# Altium schematic sheet FPGA_Core.SchDoc
size A; DocumentNumber: 5; SheetNumber: 5; SheetTotal: 8; PageSetup: Record=PageOptions|CenterHorizontal=True|CenterVertical=True|PrintScale=1.12|XCorrection=1.00|YCorrection=1.00|PrintKind=0|BorderSize=5000000|LeftOffset=0|BottomOffset=0|Orientation=2|PaperLength=1000|PaperWidth=1000|Scale=100|PaperSource=7|PrintQuality=-4|MediaType=1|DitherType=10|PaperKind=Letter|PrintScaleMode=1
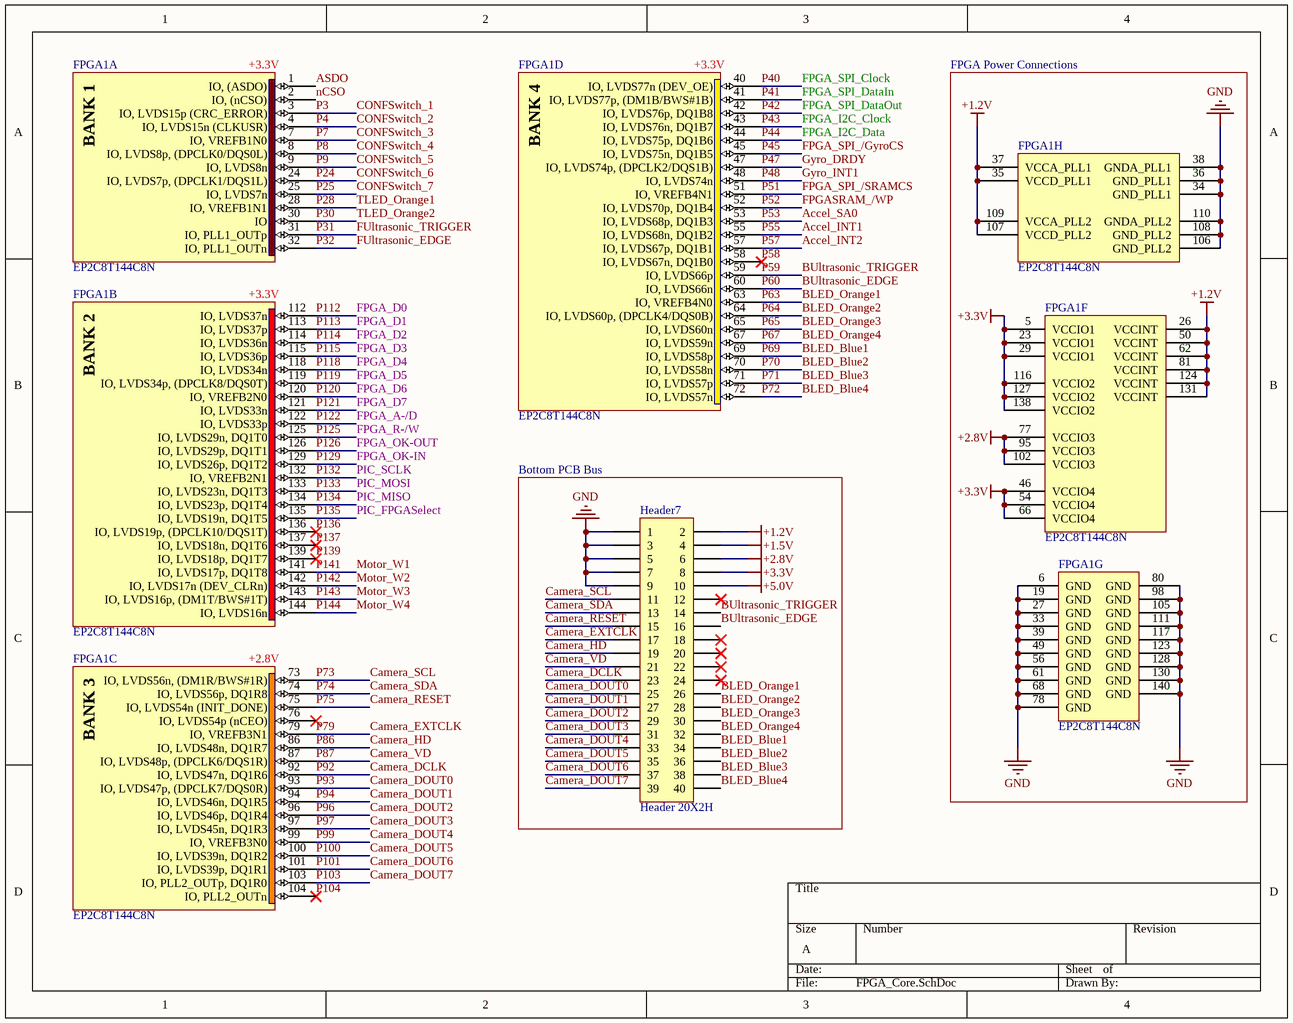
[diagram p0: FPGA_Core.SchDoc]

## Parts
FPGA1  EP2C8T144C8N  [TQFP144_N]  (parts A,B,C,D,F,G,H of 9)
Header7  Header 20X2H  [HDR2X20]

## Blocks framed on the sheet
FPGA Power Connections: FPGA1
Bottom PCB Bus: Header7

## Nets
+1.2V: FPGA1.26(VCCINT) FPGA1.35(VCCD_PLL1) FPGA1.37(VCCA_PLL1) FPGA1.50(VCCINT) FPGA1.62(VCCINT) FPGA1.81(VCCINT) FPGA1.107(VCCD_PLL2) FPGA1.109(VCCA_PLL2) FPGA1.124(VCCINT) FPGA1.131(VCCINT) Header7.2
+1.5V: Header7.4
+2.8V: FPGA1.77(VCCIO3) FPGA1.95(VCCIO3) FPGA1.102(VCCIO3) Header7.6
+3.3V: FPGA1.5(VCCIO1) FPGA1.23(VCCIO1) FPGA1.29(VCCIO1) FPGA1.46(VCCIO4) FPGA1.54(VCCIO4) FPGA1.66(VCCIO4) FPGA1.116(VCCIO2) FPGA1.127(VCCIO2) FPGA1.138(VCCIO2) Header7.8
+5.0V: Header7.10
GND: FPGA1.6(GND) FPGA1.19(GND) FPGA1.27(GND) FPGA1.33(GND) FPGA1.34(GND_PLL1) FPGA1.36(GND_PLL1) FPGA1.38(GNDA_PLL1) FPGA1.39(GND) FPGA1.49(GND) FPGA1.56(GND) FPGA1.61(GND) FPGA1.68(GND) FPGA1.78(GND) FPGA1.80(GND) FPGA1.98(GND) FPGA1.105(GND) FPGA1.106(GND_PLL2) FPGA1.108(GND_PLL2) FPGA1.110(GNDA_PLL2) FPGA1.111(GND) FPGA1.117(GND) FPGA1.123(GND) FPGA1.128(GND) FPGA1.130(GND) FPGA1.140(GND) Header7.1 Header7.3 Header7.5 Header7.7 Header7.9
Accel_INT1: FPGA1.55(IO,_LVDS68n,_DQ1B2)  [also labelled P55]
Accel_INT2: FPGA1.57(IO,_LVDS67p,_DQ1B1)  [also labelled P57]
Accel_SA0: FPGA1.53(IO,_LVDS68p,_DQ1B3)  [also labelled P53]
ASDO: FPGA1.1(IO,_(ASDO))
BLED_Blue1: FPGA1.69(IO,_LVDS58p) Header7.34  [also labelled P69]
BLED_Blue2: FPGA1.70(IO,_LVDS58n) Header7.36  [also labelled P70]
BLED_Blue3: FPGA1.71(IO,_LVDS57p) Header7.38  [also labelled P71]
BLED_Blue4: FPGA1.72(IO,_LVDS57n) Header7.40  [also labelled P72]
BLED_Orange1: FPGA1.63(IO,_VREFB4N0) Header7.26  [also labelled P63]
BLED_Orange2: FPGA1.64(IO,_LVDS60p,_(DPCLK4/DQS0B)) Header7.28  [also labelled P64]
BLED_Orange3: FPGA1.65(IO,_LVDS60n) Header7.30  [also labelled P65]
BLED_Orange4: FPGA1.67(IO,_LVDS59n) Header7.32  [also labelled P67]
BUltrasonic_EDGE: FPGA1.60(IO,_LVDS66n) Header7.16  [also labelled P60]
BUltrasonic_TRIGGER: FPGA1.59(IO,_LVDS66p) Header7.14  [also labelled P59]
Camera_DCLK: FPGA1.92(IO,_LVDS47n,_DQ1R6) Header7.23  [also labelled P92]
Camera_DOUT0: FPGA1.93(IO,_LVDS47p,_(DPCLK7/DQS0R)) Header7.25  [also labelled P93]
Camera_DOUT1: FPGA1.94(IO,_LVDS46n,_DQ1R5) Header7.27  [also labelled P94]
Camera_DOUT2: FPGA1.96(IO,_LVDS46p,_DQ1R4) Header7.29  [also labelled P96]
Camera_DOUT3: FPGA1.97(IO,_LVDS45n,_DQ1R3) Header7.31  [also labelled P97]
Camera_DOUT4: FPGA1.99(IO,_VREFB3N0) Header7.33  [also labelled P99]
Camera_DOUT5: FPGA1.100(IO,_LVDS39n,_DQ1R2) Header7.35  [also labelled P100]
Camera_DOUT6: FPGA1.101(IO,_LVDS39p,_DQ1R1) Header7.37  [also labelled P101]
Camera_DOUT7: FPGA1.103(IO,_PLL2_OUTp,_DQ1R0) Header7.39  [also labelled P103]
Camera_EXTCLK: FPGA1.79(IO,_VREFB3N1) Header7.17  [also labelled P79]
Camera_HD: FPGA1.86(IO,_LVDS48n,_DQ1R7) Header7.19  [also labelled P86]
Camera_RESET: FPGA1.75(IO,_LVDS54n_(INIT_DONE)) Header7.15  [also labelled P75]
Camera_SCL: FPGA1.73(IO,_LVDS56n,_(DM1R/BWS#1R)) Header7.11  [also labelled P73]
Camera_SDA: FPGA1.74(IO,_LVDS56p,_DQ1R8) Header7.13  [also labelled P74]
Camera_VD: FPGA1.87(IO,_LVDS48p,_(DPCLK6/DQS1R)) Header7.21  [also labelled P87]
CONFSwitch_1: FPGA1.3(IO,_LVDS15p_(CRC_ERROR))  [also labelled P3]
CONFSwitch_2: FPGA1.4(IO,_LVDS15n_(CLKUSR))  [also labelled P4]
CONFSwitch_3: FPGA1.7(IO,_VREFB1N0)  [also labelled P7]
CONFSwitch_4: FPGA1.8(IO,_LVDS8p,_(DPCLK0/DQS0L))  [also labelled P8]
CONFSwitch_5: FPGA1.9(IO,_LVDS8n)  [also labelled P9]
CONFSwitch_6: FPGA1.24(IO,_LVDS7p,_(DPCLK1/DQS1L))  [also labelled P24]
CONFSwitch_7: FPGA1.25(IO,_LVDS7n)  [also labelled P25]
FPGA_A-/D: FPGA1.122(IO,_LVDS33p)  [also labelled P122]
FPGA_D0: FPGA1.112(IO,_LVDS37n)  [also labelled P112]
FPGA_D1: FPGA1.113(IO,_LVDS37p)  [also labelled P113]
FPGA_D2: FPGA1.114(IO,_LVDS36n)  [also labelled P114]
FPGA_D3: FPGA1.115(IO,_LVDS36p)  [also labelled P115]
FPGA_D4: FPGA1.118(IO,_LVDS34n)  [also labelled P118]
FPGA_D5: FPGA1.119(IO,_LVDS34p,_(DPCLK8/DQS0T))  [also labelled P119]
FPGA_D6: FPGA1.120(IO,_VREFB2N0)  [also labelled P120]
FPGA_D7: FPGA1.121(IO,_LVDS33n)  [also labelled P121]
FPGA_I2C_Clock: FPGA1.43(IO,_LVDS76n,_DQ1B7)  [also labelled P43]
FPGA_I2C_Data: FPGA1.44(IO,_LVDS75p,_DQ1B6)  [also labelled P44]
FPGA_OK-IN: FPGA1.129(IO,_LVDS26p,_DQ1T2)  [also labelled P129]
FPGA_OK-OUT: FPGA1.126(IO,_LVDS29p,_DQ1T1)  [also labelled P126]
FPGA_R-/W: FPGA1.125(IO,_LVDS29n,_DQ1T0)  [also labelled P125]
FPGA_SPI_/GyroCS: FPGA1.45(IO,_LVDS75n,_DQ1B5)  [also labelled P45]
FPGA_SPI_/SRAMCS: FPGA1.51(IO,_VREFB4N1)  [also labelled P51]
FPGA_SPI_Clock: FPGA1.40(IO,_LVDS77n_(DEV_OE))  [also labelled P40]
FPGA_SPI_DataIn: FPGA1.41(IO,_LVDS77p,_(DM1B/BWS#1B))  [also labelled P41]
FPGA_SPI_DataOut: FPGA1.42(IO,_LVDS76p,_DQ1B8)  [also labelled P42]
FPGASRAM_/WP: FPGA1.52(IO,_LVDS70p,_DQ1B4)  [also labelled P52]
FUltrasonic_EDGE: FPGA1.32(IO,_PLL1_OUTn)  [also labelled P32]
FUltrasonic_TRIGGER: FPGA1.31(IO,_PLL1_OUTp)  [also labelled P31]
Gyro_DRDY: FPGA1.47(IO,_LVDS74p,_(DPCLK2/DQS1B))  [also labelled P47]
Gyro_INT1: FPGA1.48(IO,_LVDS74n)  [also labelled P48]
Motor_W1: FPGA1.141(IO,_LVDS17p,_DQ1T8)  [also labelled P141]
Motor_W2: FPGA1.142(IO,_LVDS17n_(DEV_CLRn))  [also labelled P142]
Motor_W3: FPGA1.143(IO,_LVDS16p,_(DM1T/BWS#1T))  [also labelled P143]
Motor_W4: FPGA1.144(IO,_LVDS16n)  [also labelled P144]
nCSO: FPGA1.2(IO,_(nCSO))
P28: FPGA1.28(IO,_VREFB1N1)  [also labelled TLED_Orange1]
P30: FPGA1.30(IO)  [also labelled TLED_Orange2]
P58: FPGA1.58(IO,_LVDS67n,_DQ1B0)
P104: FPGA1.104(IO,_PLL2_OUTn)
P132: FPGA1.132(IO,_VREFB2N1)  [also labelled PIC_SCLK]
P133: FPGA1.133(IO,_LVDS23n,_DQ1T3)  [also labelled PIC_MOSI]
P134: FPGA1.134(IO,_LVDS23p,_DQ1T4)  [also labelled PIC_MISO]
P135: FPGA1.135(IO,_LVDS19n,_DQ1T5)  [also labelled PIC_FPGASelect]
P136: FPGA1.136(IO,_LVDS19p,_(DPCLK10/DQS1T))
P137: FPGA1.137(IO,_LVDS18n,_DQ1T6)
P139: FPGA1.139(IO,_LVDS18p,_DQ1T7)

Not connected (* = marked no-connect by the designer): FPGA1 76(IO,_LVDS54p_(nCEO))*; Header7 12* 18* 20* 22* 24*

## Notes on the sheet
- (near FPGA1) +3.3V
- (near FPGA1) +2.8V
- (in symbol EP2C8T144C8N, part A) BANK 1
- (in symbol EP2C8T144C8N, part B) BANK 2
- (in symbol EP2C8T144C8N, part C) BANK 3
- (in symbol EP2C8T144C8N, part D) BANK 4

## Library data of the parts
FPGA1 = EP2C8T144C8N: Cyclone II Family, 1.2V FPGA, 85 I/O Pins, 2 PLLs, 144-Pin TQFP, Speed Grade 8, Commercial Grade, Pb-Free; Published: 4-Mar-2005; LatestRevisionDate: 14-May-2007; LatestRevisionNote: DATA0 pin is now INPUT.; DatasheetVersion: ver3.3, Feb-2008; PackageVersion: ver15.4, Dec-2008; PackageReference: TQFP144; Publisher: Altium Limited; PackageDescription: 144-Pin Plastic Thin Quad Flat Pack (TQFP144) - Wire Bond; Supplier 1: Digi-Key; Supplier Part Number 1: 544-1666-ND; Supplier 2: Farnell; Supplier Part Number 2: 1453487; Supplier 3: Farnell; Supplier Part Number 3: 1662256; Code_JEDEC: MS-026-BFB; ComponentLink1Description: Manufacturer Link; ComponentLink1URL: http://www.altera.com/products/devices/cyclone2/cy2-index.jsp; ComponentLink2Description: Handbook; ComponentLink2URL: http://www.altera.com/literature/hb/cyc2/cyc2_cii5v1.pdf; ComponentLink3Description: Packaging Specification; ComponentLink3URL: http://www.altera.com/literature/ds/dspkg.pdf
Header7 = Header 20X2H: Header, 20-Pin, Dual row, Right Angle; LatestRevisionDate: 17-Jul-2002; LatestRevisionNote: Re-released for DXP Platform.; Publisher: Altium Limited